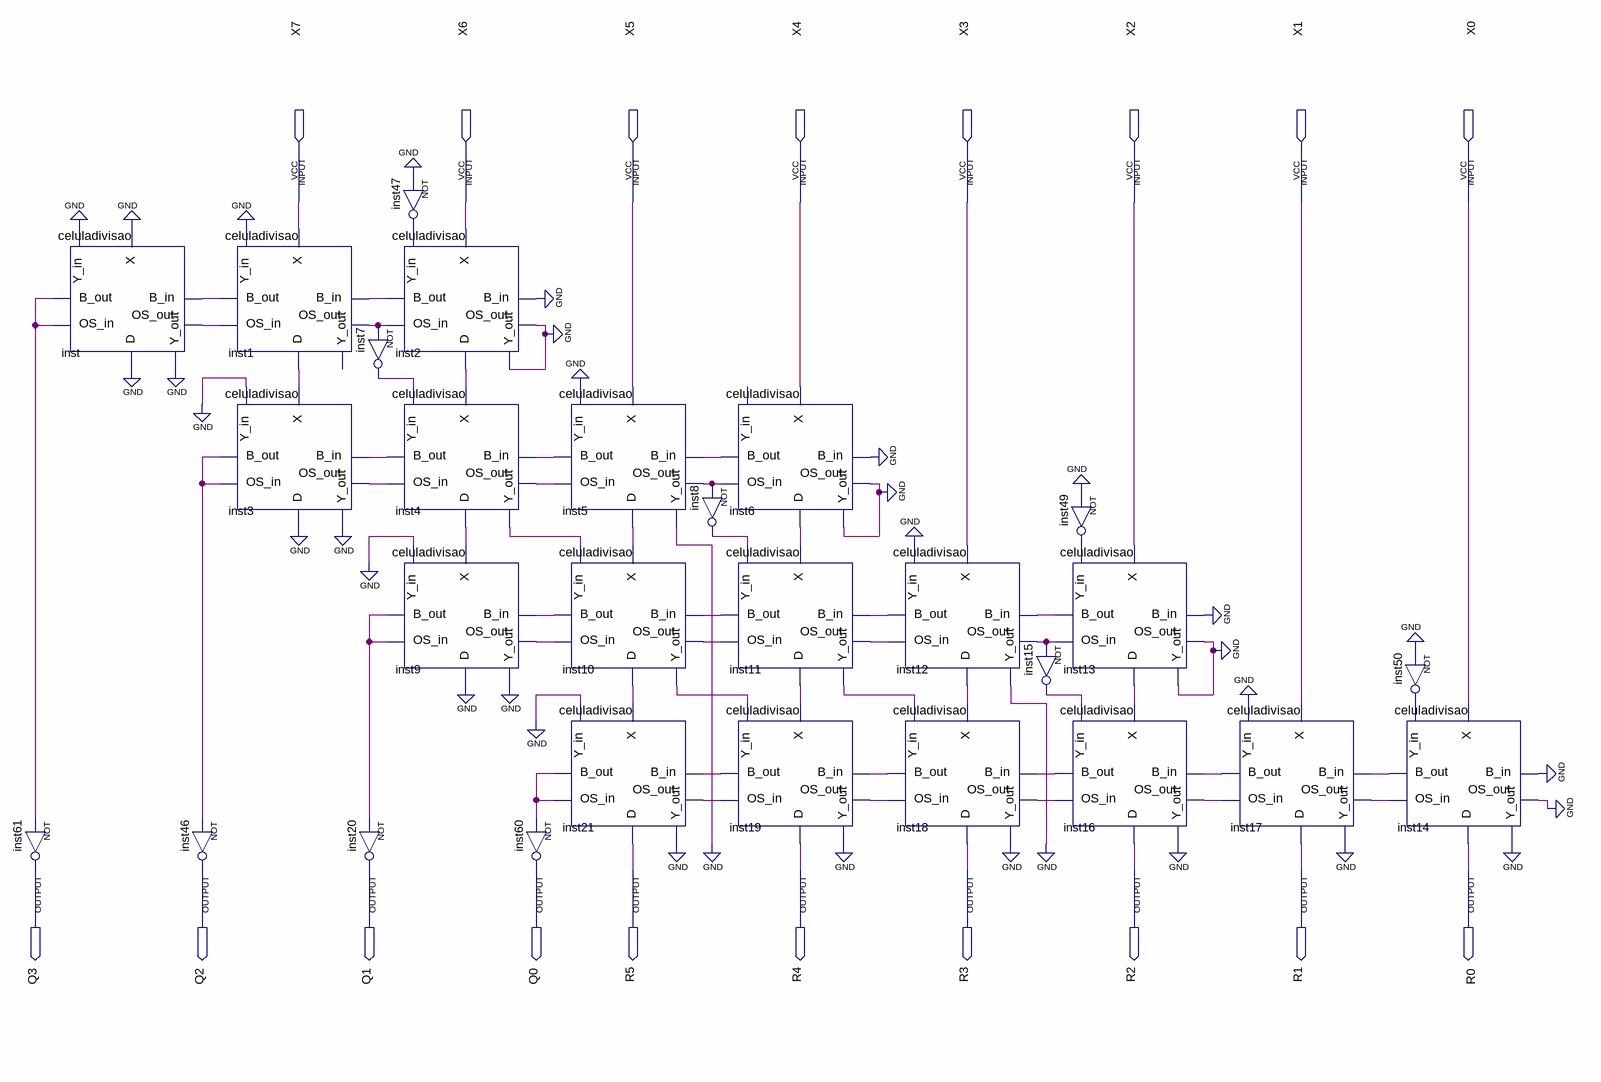
[diagram p0: schematic sheet]
// Quartus schematic raizoitobits.bdf as structural Verilog: 28 symbols, 18 pins
module raizoitobits (
  input  X7,
  input  X6,
  input  X5,
  input  X4,
  input  X3,
  input  X2,
  input  X1,
  input  X0,
  output Q3,
  output Q2,
  output Q1,
  output Q0,
  output R5,
  output R4,
  output R3,
  output R2,
  output R1,
  output R0
);

  wire inst1_b_out, inst1_d, inst1_os_out, inst2_b_out, inst2_d, inst2_os_out, inst3_b_out, inst3_d,
       inst3_os_out, inst3_y_out, inst4_b_out, inst4_d, inst4_os_out, inst4_y_out, inst5_b_out, inst5_d,
       inst5_os_out, inst5_y_out, inst6_b_out, inst6_d, inst6_os_out, inst7_out, inst8_out, inst9_b_out,
       inst9_d, inst9_os_out, inst9_y_out, inst10_b_out, inst10_d, inst10_os_out, inst10_y_out, inst11_b_out,
       inst11_d, inst11_os_out, inst11_y_out, inst12_b_out, inst12_d, inst12_os_out, inst12_y_out,
       inst13_b_out, inst13_d, inst13_os_out, inst14_b_out, inst14_os_out, inst14_y_out, inst15_out,
       inst16_b_out, inst16_os_out, inst16_y_out, inst17_b_out, inst17_os_out, inst17_y_out, inst18_b_out,
       inst18_os_out, inst18_y_out, inst19_b_out, inst19_os_out, inst19_y_out, inst21_b_out, inst21_os_out,
       inst21_y_out, inst47_out, inst49_out, inst50_out, inst_b_out, inst_d, inst_os_out, inst_y_out;

  celuladivisao inst (
    .X(1'b0), .Y_in(1'b0), .B_in(inst1_b_out), .OS_in(inst_b_out), .B_out(inst_b_out), .OS_out(inst_os_out),
    .D(inst_d), .Y_out(inst_y_out));
  not inst61 (Q3, inst_b_out);
  not inst46 (Q2, inst3_b_out);
  celuladivisao inst1 (
    .X(X7), .Y_in(1'b0), .B_in(inst2_b_out), .OS_in(inst_os_out), .B_out(inst1_b_out), .OS_out(inst1_os_out),
    .D(inst1_d));  // open: Y_out
  celuladivisao inst3 (
    .X(inst1_d), .Y_in(1'b0), .B_in(inst4_b_out), .OS_in(inst3_b_out), .B_out(inst3_b_out),
    .OS_out(inst3_os_out), .D(inst3_d), .Y_out(inst3_y_out));
  not inst47 (inst47_out, 1'b0);
  celuladivisao inst2 (
    .X(X6), .Y_in(inst47_out), .B_in(1'b0), .OS_in(inst1_os_out), .B_out(inst2_b_out), .OS_out(inst2_os_out),
    .D(inst2_d), .Y_out(inst2_os_out));
  not inst7 (inst7_out, inst1_os_out);
  celuladivisao inst4 (
    .X(inst2_d), .Y_in(inst7_out), .B_in(inst5_b_out), .OS_in(inst3_os_out), .B_out(inst4_b_out),
    .OS_out(inst4_os_out), .D(inst4_d), .Y_out(inst4_y_out));
  celuladivisao inst9 (
    .X(inst4_d), .Y_in(1'b0), .B_in(inst10_b_out), .OS_in(inst9_b_out), .B_out(inst9_b_out),
    .OS_out(inst9_os_out), .D(inst9_d), .Y_out(inst9_y_out));
  not inst20 (Q1, inst9_b_out);
  not inst60 (Q0, inst21_b_out);
  celuladivisao inst5 (
    .X(X5), .Y_in(1'b0), .B_in(inst6_b_out), .OS_in(inst4_os_out), .B_out(inst5_b_out),
    .OS_out(inst5_os_out), .D(inst5_d), .Y_out(inst5_y_out));
  celuladivisao inst10 (
    .X(inst5_d), .Y_in(inst4_y_out), .B_in(inst11_b_out), .OS_in(inst9_os_out), .B_out(inst10_b_out),
    .OS_out(inst10_os_out), .D(inst10_d), .Y_out(inst10_y_out));
  celuladivisao inst21 (
    .X(inst10_d), .Y_in(1'b0), .B_in(inst19_b_out), .OS_in(inst21_b_out), .B_out(inst21_b_out),
    .OS_out(inst21_os_out), .D(R5), .Y_out(inst21_y_out));
  celuladivisao inst6 (
    .X(X4), .B_in(1'b0), .OS_in(inst5_os_out), .B_out(inst6_b_out), .OS_out(inst6_os_out), .D(inst6_d),
    .Y_out(inst6_os_out));  // open: Y_in
  not inst8 (inst8_out, inst5_os_out);
  celuladivisao inst11 (
    .X(inst6_d), .Y_in(inst8_out), .B_in(inst12_b_out), .OS_in(inst10_os_out), .B_out(inst11_b_out),
    .OS_out(inst11_os_out), .D(inst11_d), .Y_out(inst11_y_out));
  celuladivisao inst19 (
    .X(inst11_d), .Y_in(inst10_y_out), .B_in(inst18_b_out), .OS_in(inst21_os_out), .B_out(inst19_b_out),
    .OS_out(inst19_os_out), .D(R4), .Y_out(inst19_y_out));
  celuladivisao inst12 (
    .X(X3), .Y_in(1'b0), .B_in(inst13_b_out), .OS_in(inst11_os_out), .B_out(inst12_b_out),
    .OS_out(inst12_os_out), .D(inst12_d), .Y_out(inst12_y_out));
  celuladivisao inst18 (
    .X(inst12_d), .Y_in(inst11_y_out), .B_in(inst16_b_out), .OS_in(inst19_os_out), .B_out(inst18_b_out),
    .OS_out(inst18_os_out), .D(R3), .Y_out(inst18_y_out));
  not inst15 (inst15_out, inst12_os_out);
  not inst49 (inst49_out, 1'b0);
  celuladivisao inst13 (
    .X(X2), .Y_in(inst49_out), .B_in(1'b0), .OS_in(inst12_os_out), .B_out(inst13_b_out),
    .OS_out(inst13_os_out), .D(inst13_d), .Y_out(inst13_os_out));
  celuladivisao inst16 (
    .X(inst13_d), .Y_in(inst15_out), .B_in(inst17_b_out), .OS_in(inst18_os_out), .B_out(inst16_b_out),
    .OS_out(inst16_os_out), .D(R2), .Y_out(inst16_y_out));
  celuladivisao inst17 (
    .X(X1), .Y_in(1'b0), .B_in(inst14_b_out), .OS_in(inst16_os_out), .B_out(inst17_b_out),
    .OS_out(inst17_os_out), .D(R1), .Y_out(inst17_y_out));
  celuladivisao inst14 (
    .X(X0), .Y_in(inst50_out), .B_in(1'b0), .OS_in(inst17_os_out), .B_out(inst14_b_out),
    .OS_out(inst14_os_out), .D(R0), .Y_out(inst14_y_out));
  not inst50 (inst50_out, 1'b0);
  // also tied to GND on the sheet: {inst2_os_out, inst6_os_out, inst13_os_out, inst14_os_out, inst5_y_out, inst12_y_out, inst_d, inst_y_out, inst3_d, inst3_y_out, inst9_d, inst9_y_out, inst21_y_out, inst19_y_out, inst18_y_out, inst16_y_out, inst17_y_out, inst14_y_out}
endmodule
